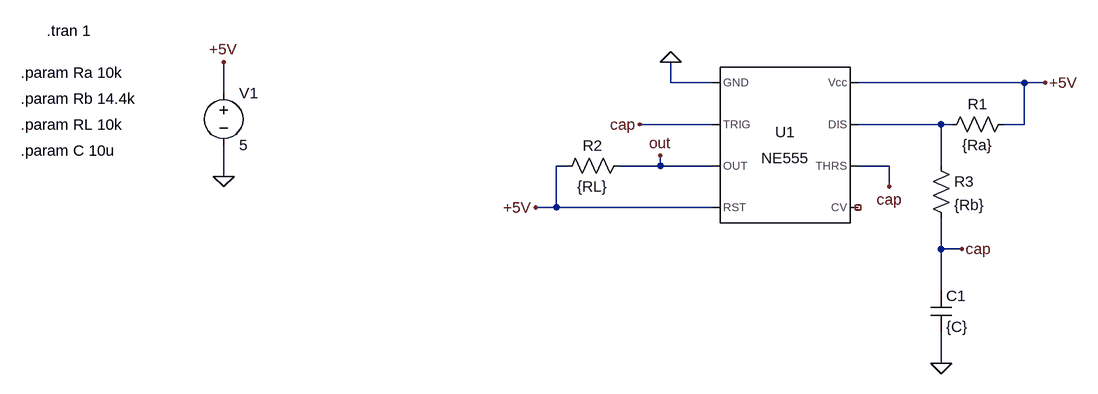
[diagram p0: schematic NE555-Astable_Operation-PWM.asc]
NE555-Astable_Operation-PWM.asc, the LTspice schematic file:
Version 4
SHEET 1 1460 680
WIRE 736 112 736 80
WIRE 800 112 736 112
WIRE 1280 112 1024 112
WIRE 1312 112 1280 112
WIRE 48 128 48 80
WIRE 800 176 688 176
WIRE 1152 176 1024 176
WIRE 1168 176 1152 176
WIRE 1280 176 1280 112
WIRE 1280 176 1248 176
WIRE 576 240 560 240
WIRE 720 240 720 224
WIRE 720 240 656 240
WIRE 800 240 720 240
WIRE 1072 240 1024 240
WIRE 1152 240 1152 176
WIRE 48 256 48 208
WIRE 1072 272 1072 240
WIRE 560 304 560 240
WIRE 560 304 528 304
WIRE 800 304 560 304
WIRE 1152 368 1152 320
WIRE 1184 368 1152 368
WIRE 1152 432 1152 368
WIRE 1152 544 1152 496
FLAG 48 256 0
FLAG 48 80 +5V
FLAG 1312 112 +5V
FLAG 736 80 0
FLAG 528 304 +5V
FLAG 1152 544 0
FLAG 720 224 out
FLAG 1184 368 cap
FLAG 1072 272 cap
FLAG 688 176 cap
SYMBOL Misc\\NE555 912 208 R0
SYMATTR InstName U1
SYMBOL voltage 48 112 R0
WINDOW 123 0 0 Left 0
WINDOW 39 0 0 Left 0
SYMATTR InstName V1
SYMATTR Value 5
SYMBOL res 1264 160 R90
WINDOW 0 0 56 VBottom 2
WINDOW 3 32 56 VTop 2
SYMATTR InstName R1
SYMATTR Value {Ra}
SYMBOL cap 1136 432 R0
SYMATTR InstName C1
SYMATTR Value {C}
SYMBOL res 672 224 R90
WINDOW 0 0 56 VBottom 2
WINDOW 3 32 56 VTop 2
SYMATTR InstName R2
SYMATTR Value {RL}
SYMBOL res 1136 224 R0
SYMATTR InstName R3
SYMATTR Value {Rb}
TEXT -224 32 Left 2 !.tran 1
TEXT -264 96 Left 2 !.param Ra 10k
TEXT -264 176 Left 2 !.param RL 10k
TEXT -264 216 Left 2 !.param C 10u
TEXT -264 136 Left 2 !.param Rb 14.4k

The netlist it stands for:
* NE555-Astable_Operation-PWM.asc
XU1 0 cap out +5V NC_01 cap N001 +5V NE555  ; pins GND TRIG OUT RST CV THRS DIS Vcc
V1 +5V 0 5
R1 +5V N001 {Ra}
C1 cap 0 {C}
R2 out +5V {RL}
R3 N001 cap {Rb}
.tran 1
.param Ra 10k
.param RL 10k
.param C 10u
.param Rb 14.4k
.lib NE555.sub
.backanno
.end